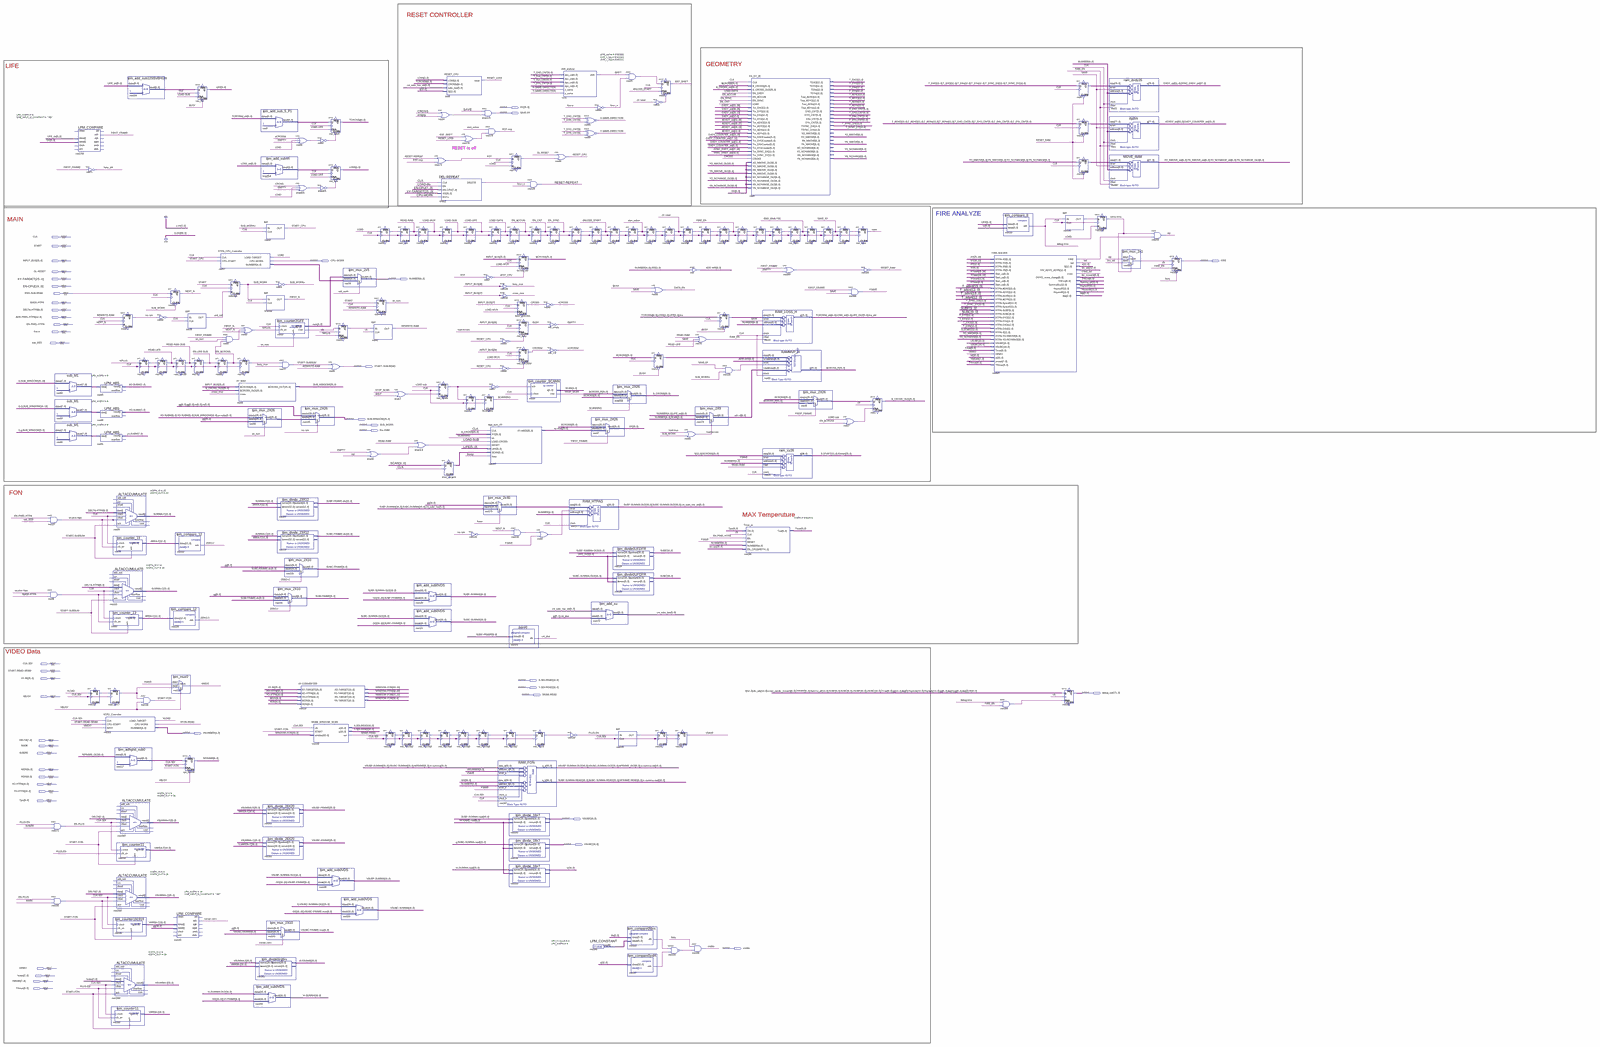
[diagram p0: schematic sheet, whole]
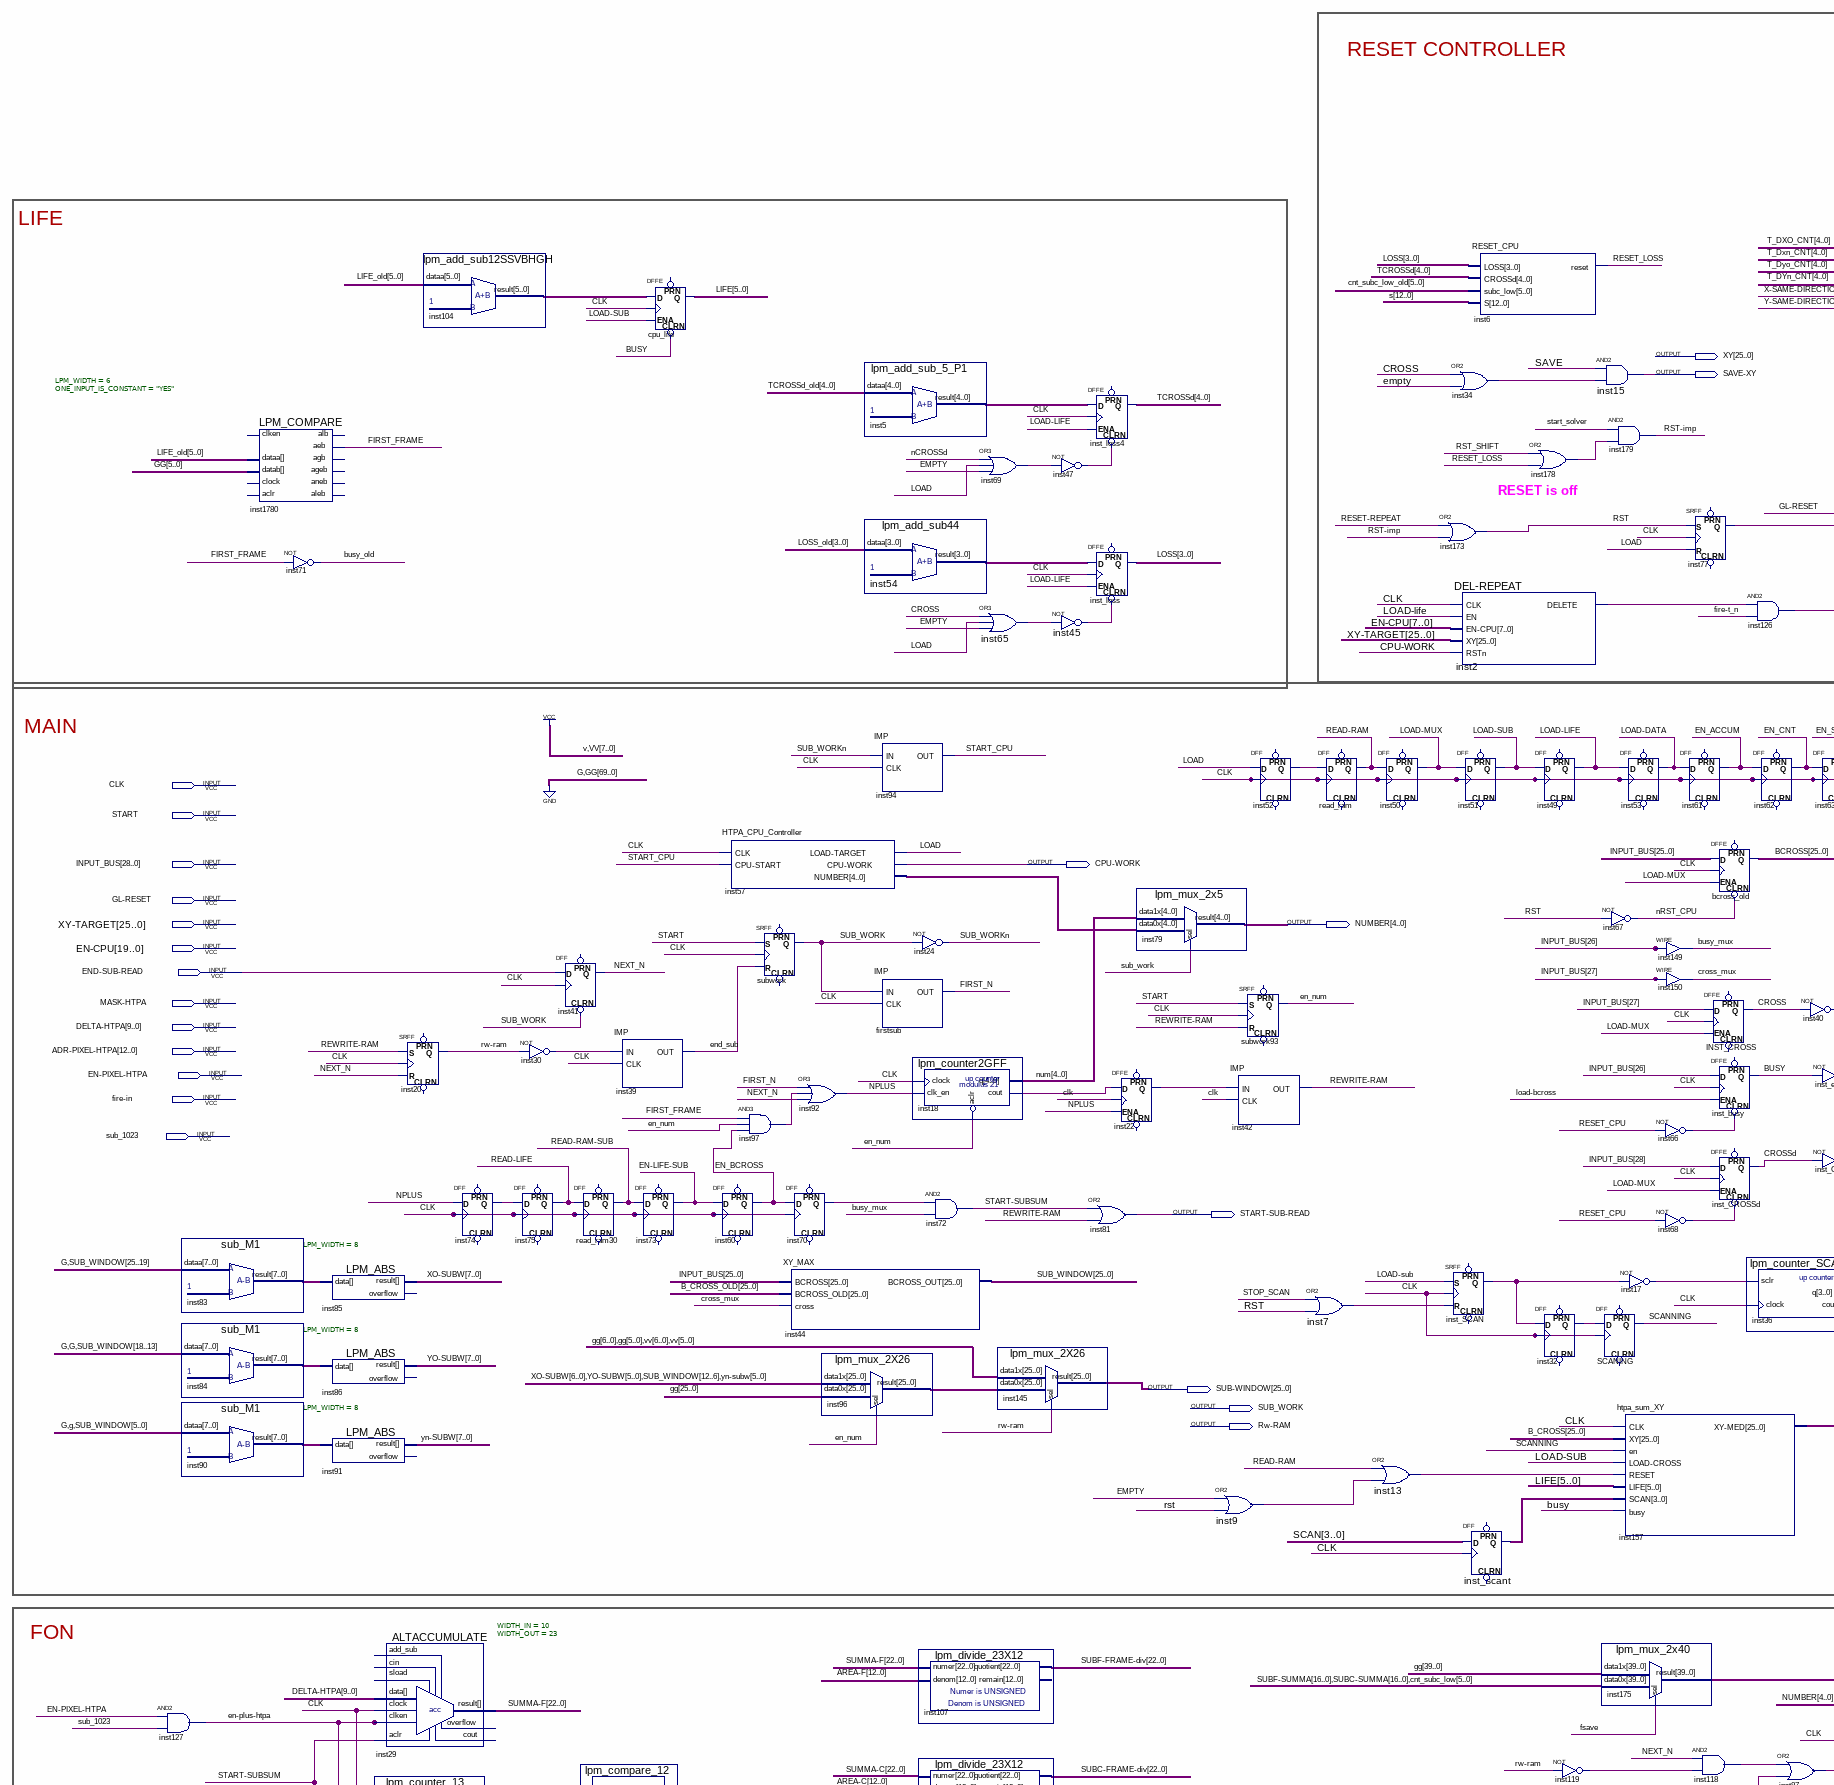
[diagram p1: schematic sheet, upper left part]
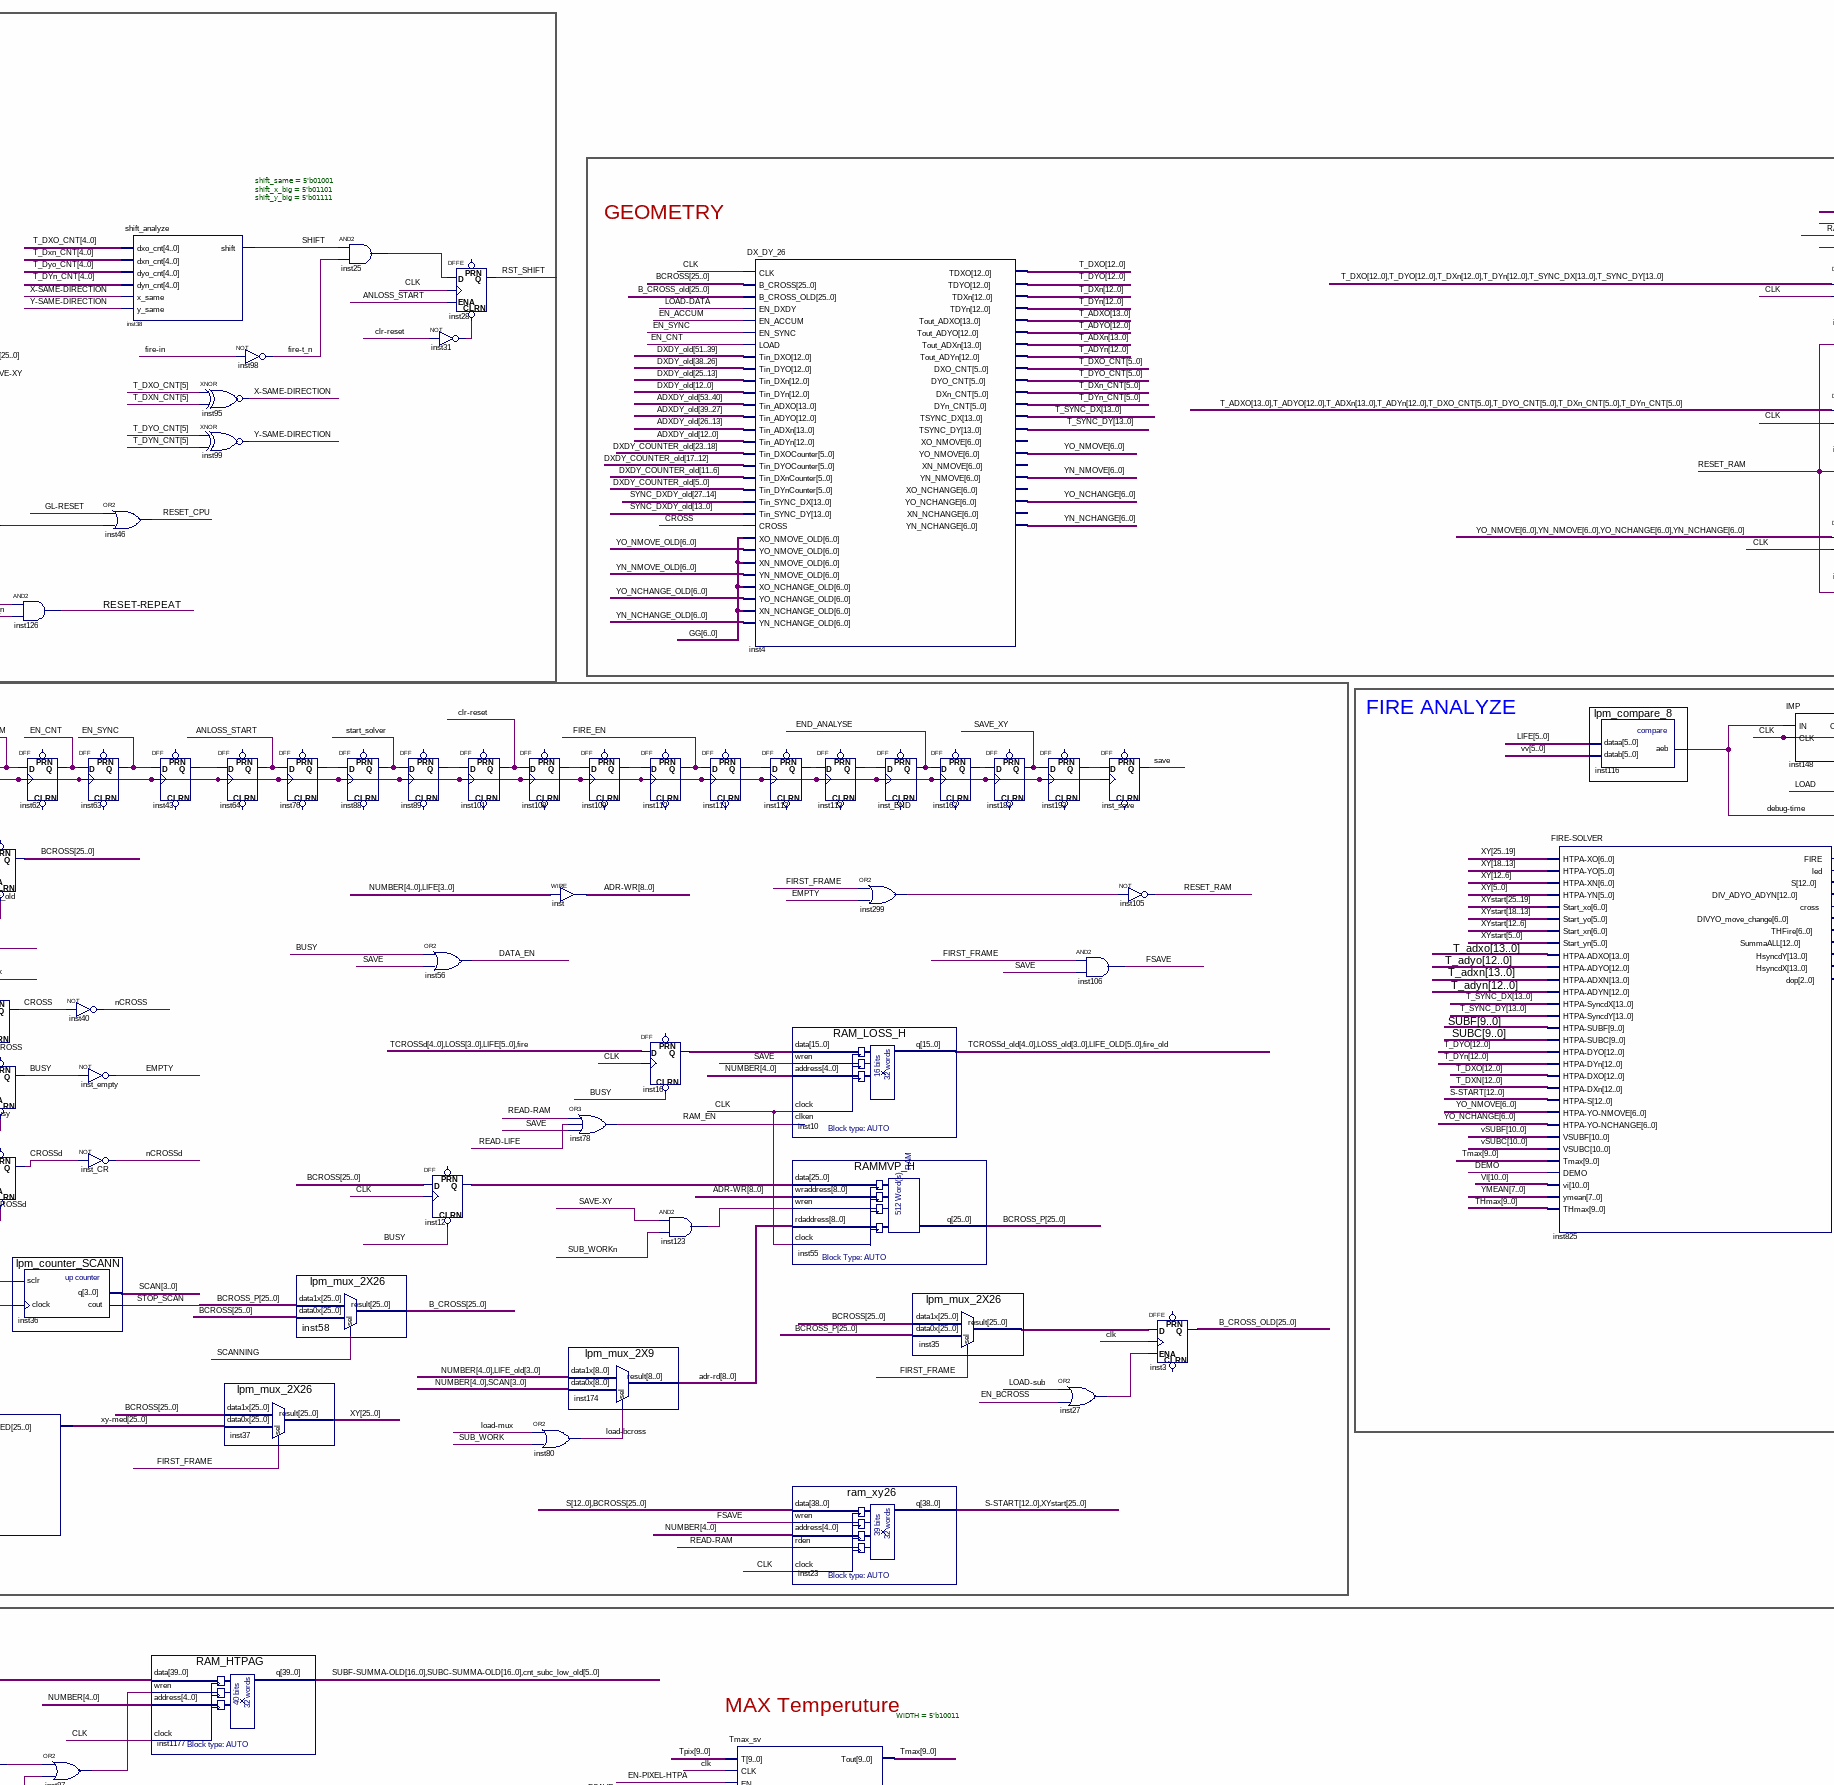
[diagram p2: schematic sheet, upper centre part]
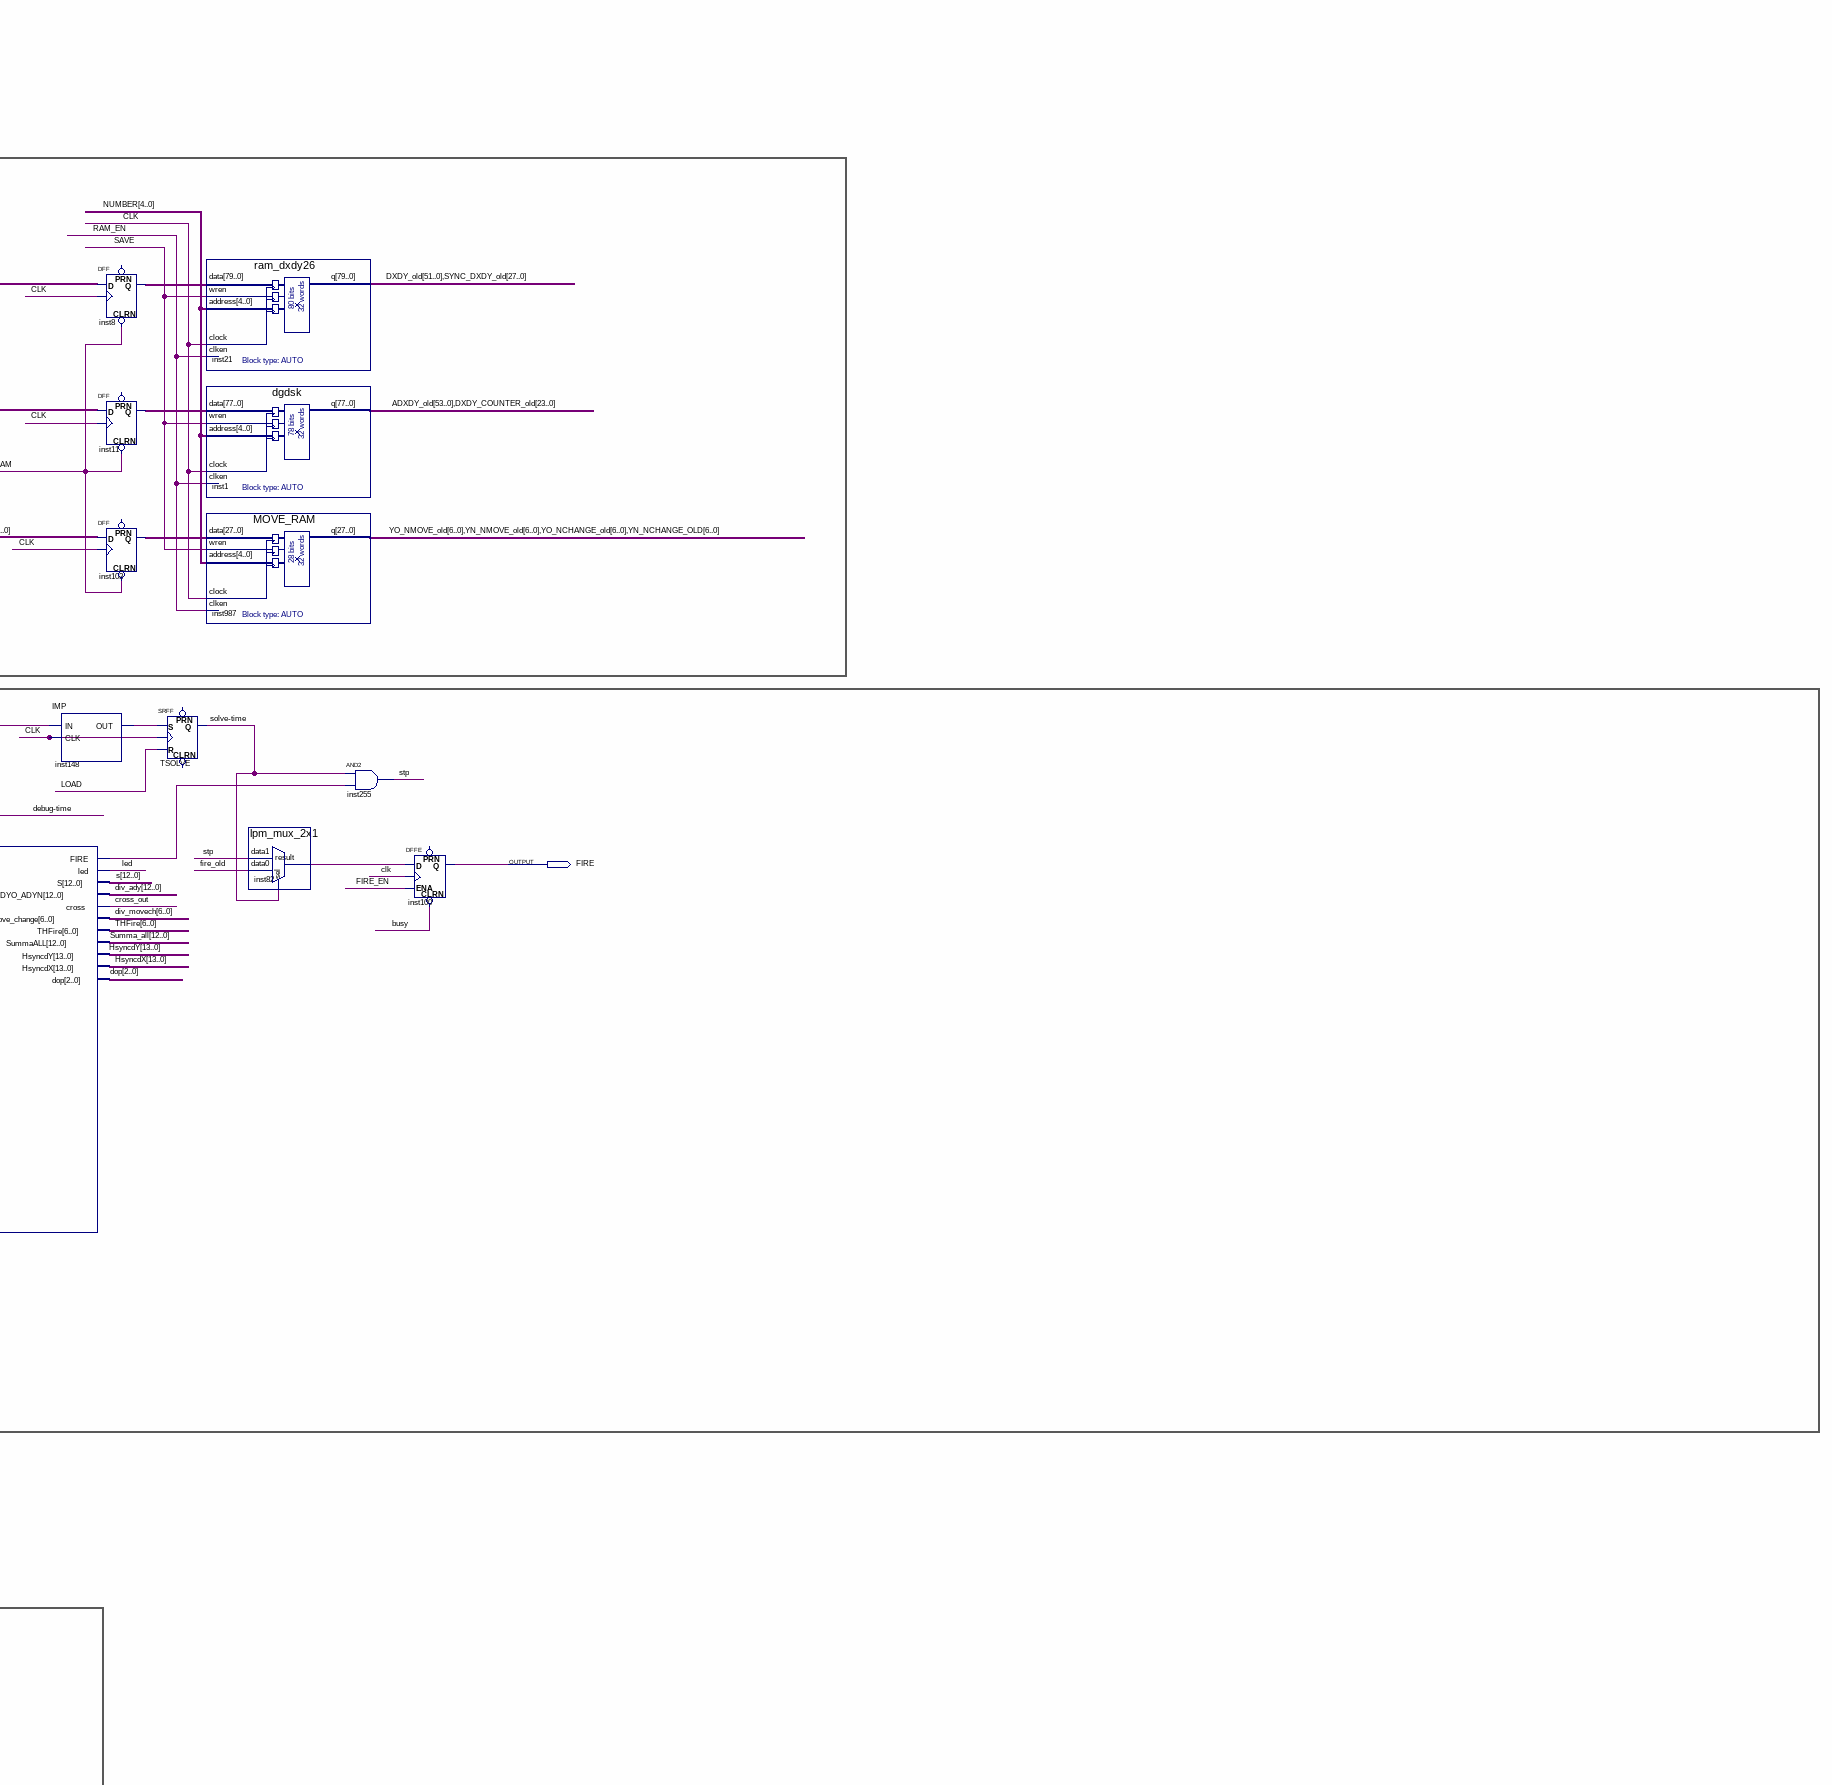
[diagram p3: schematic sheet, upper right part]
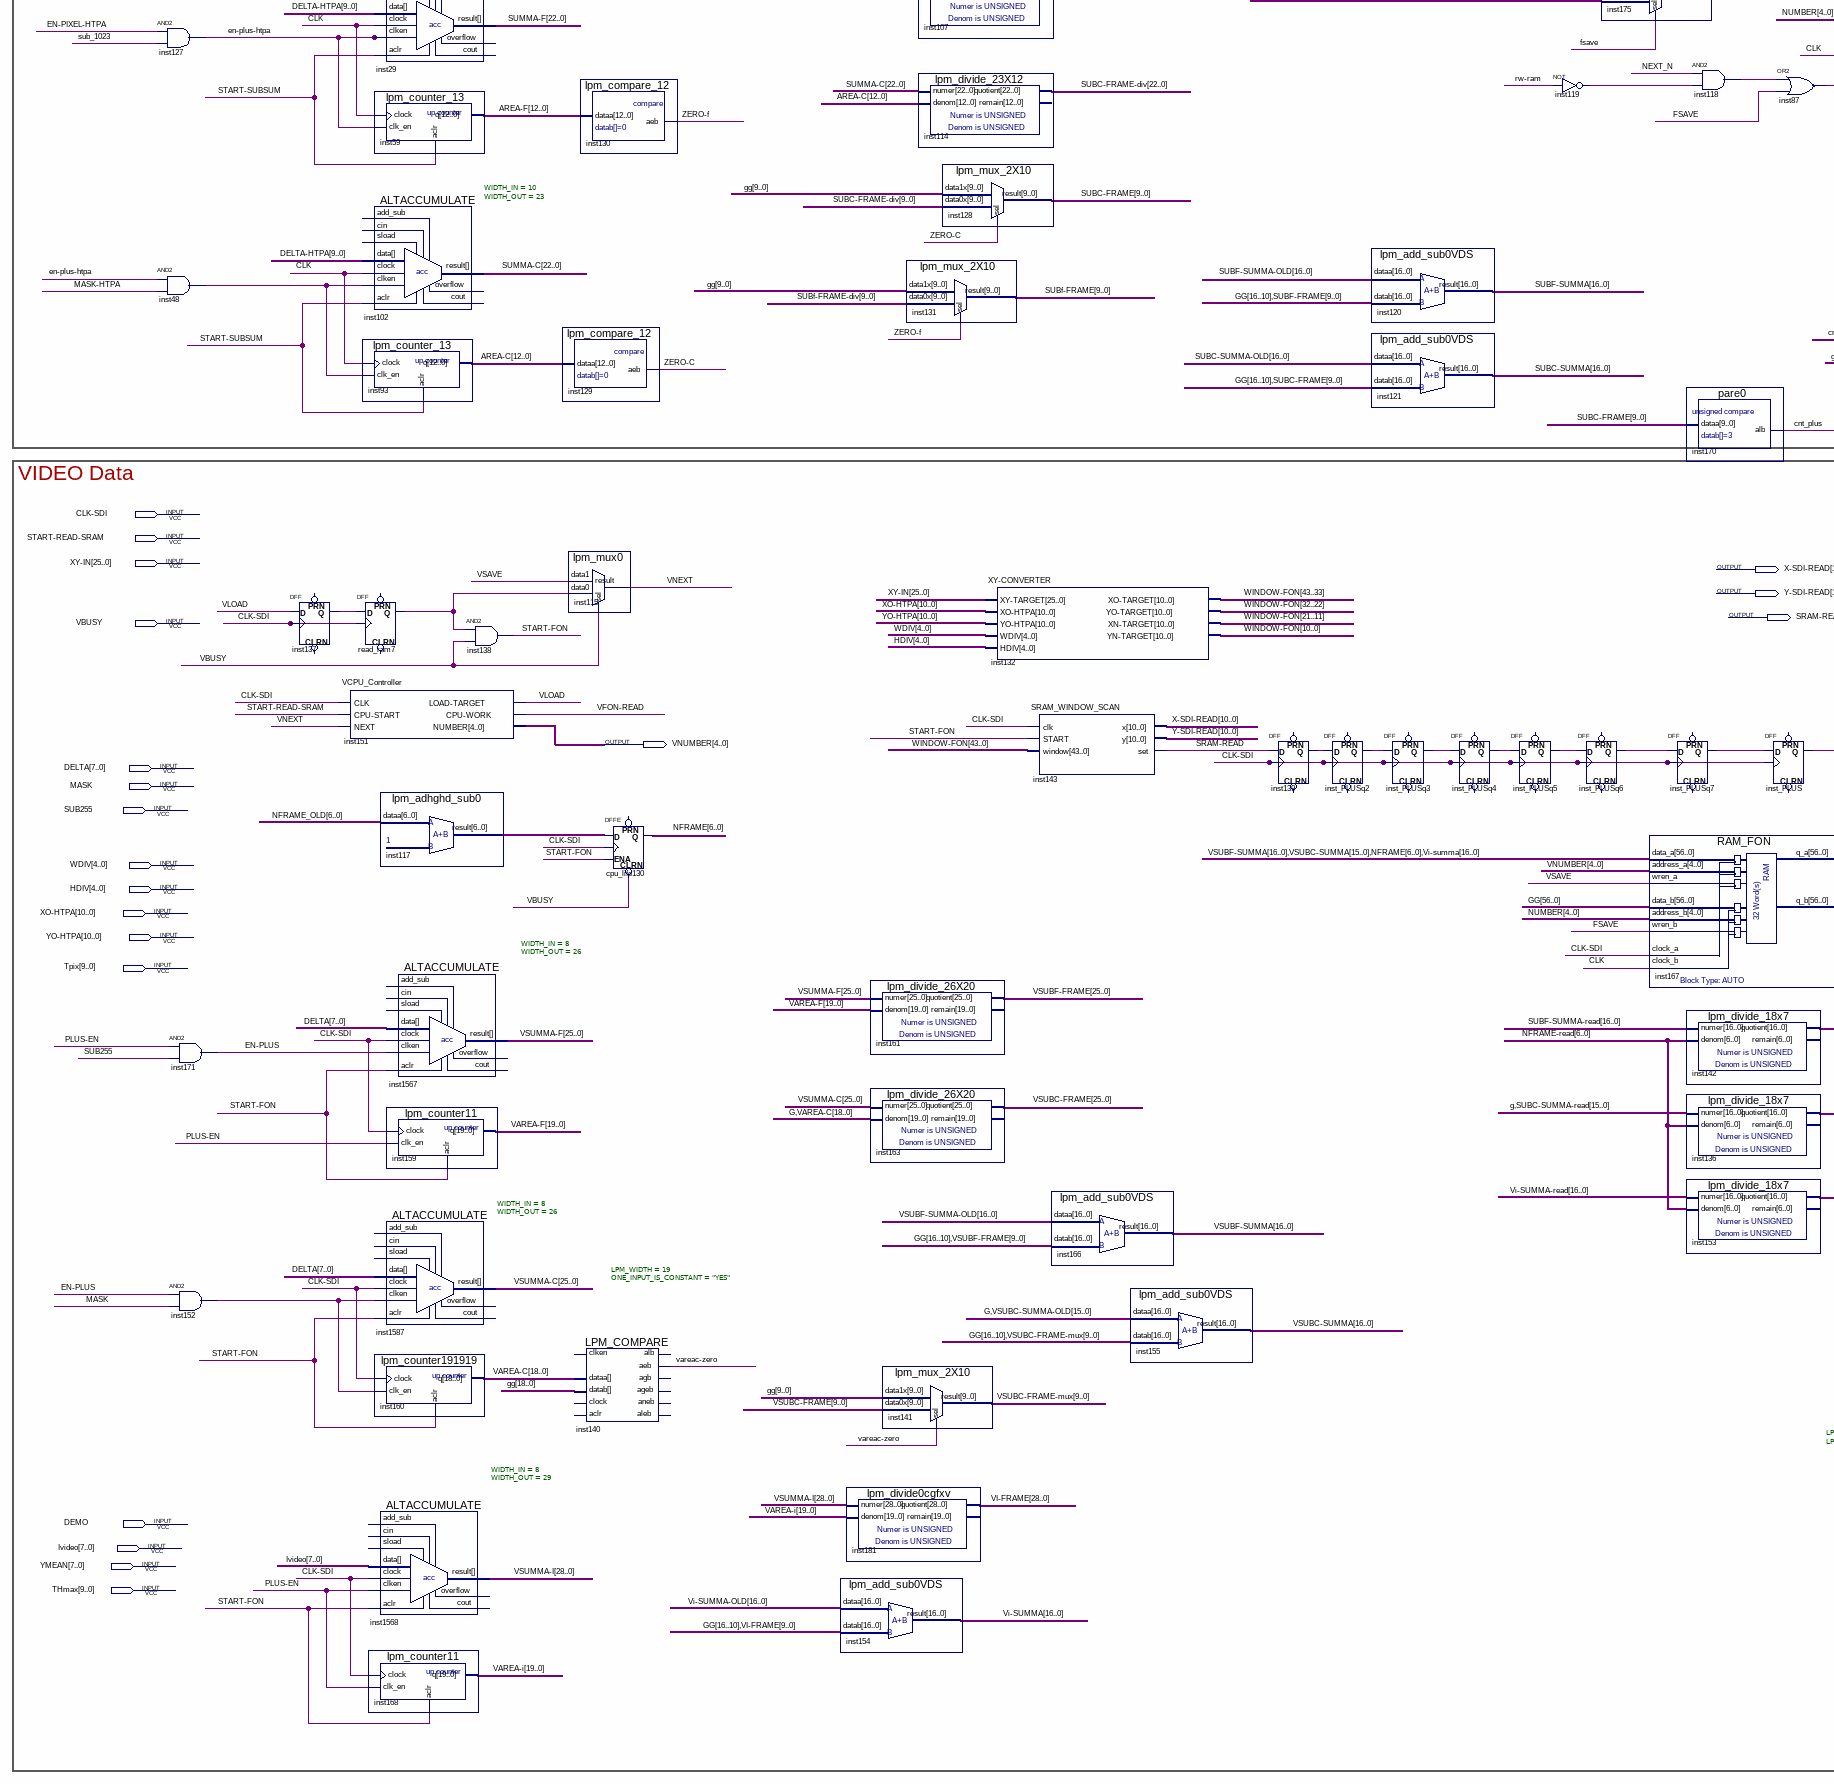
[diagram p4: schematic sheet, lower left part]
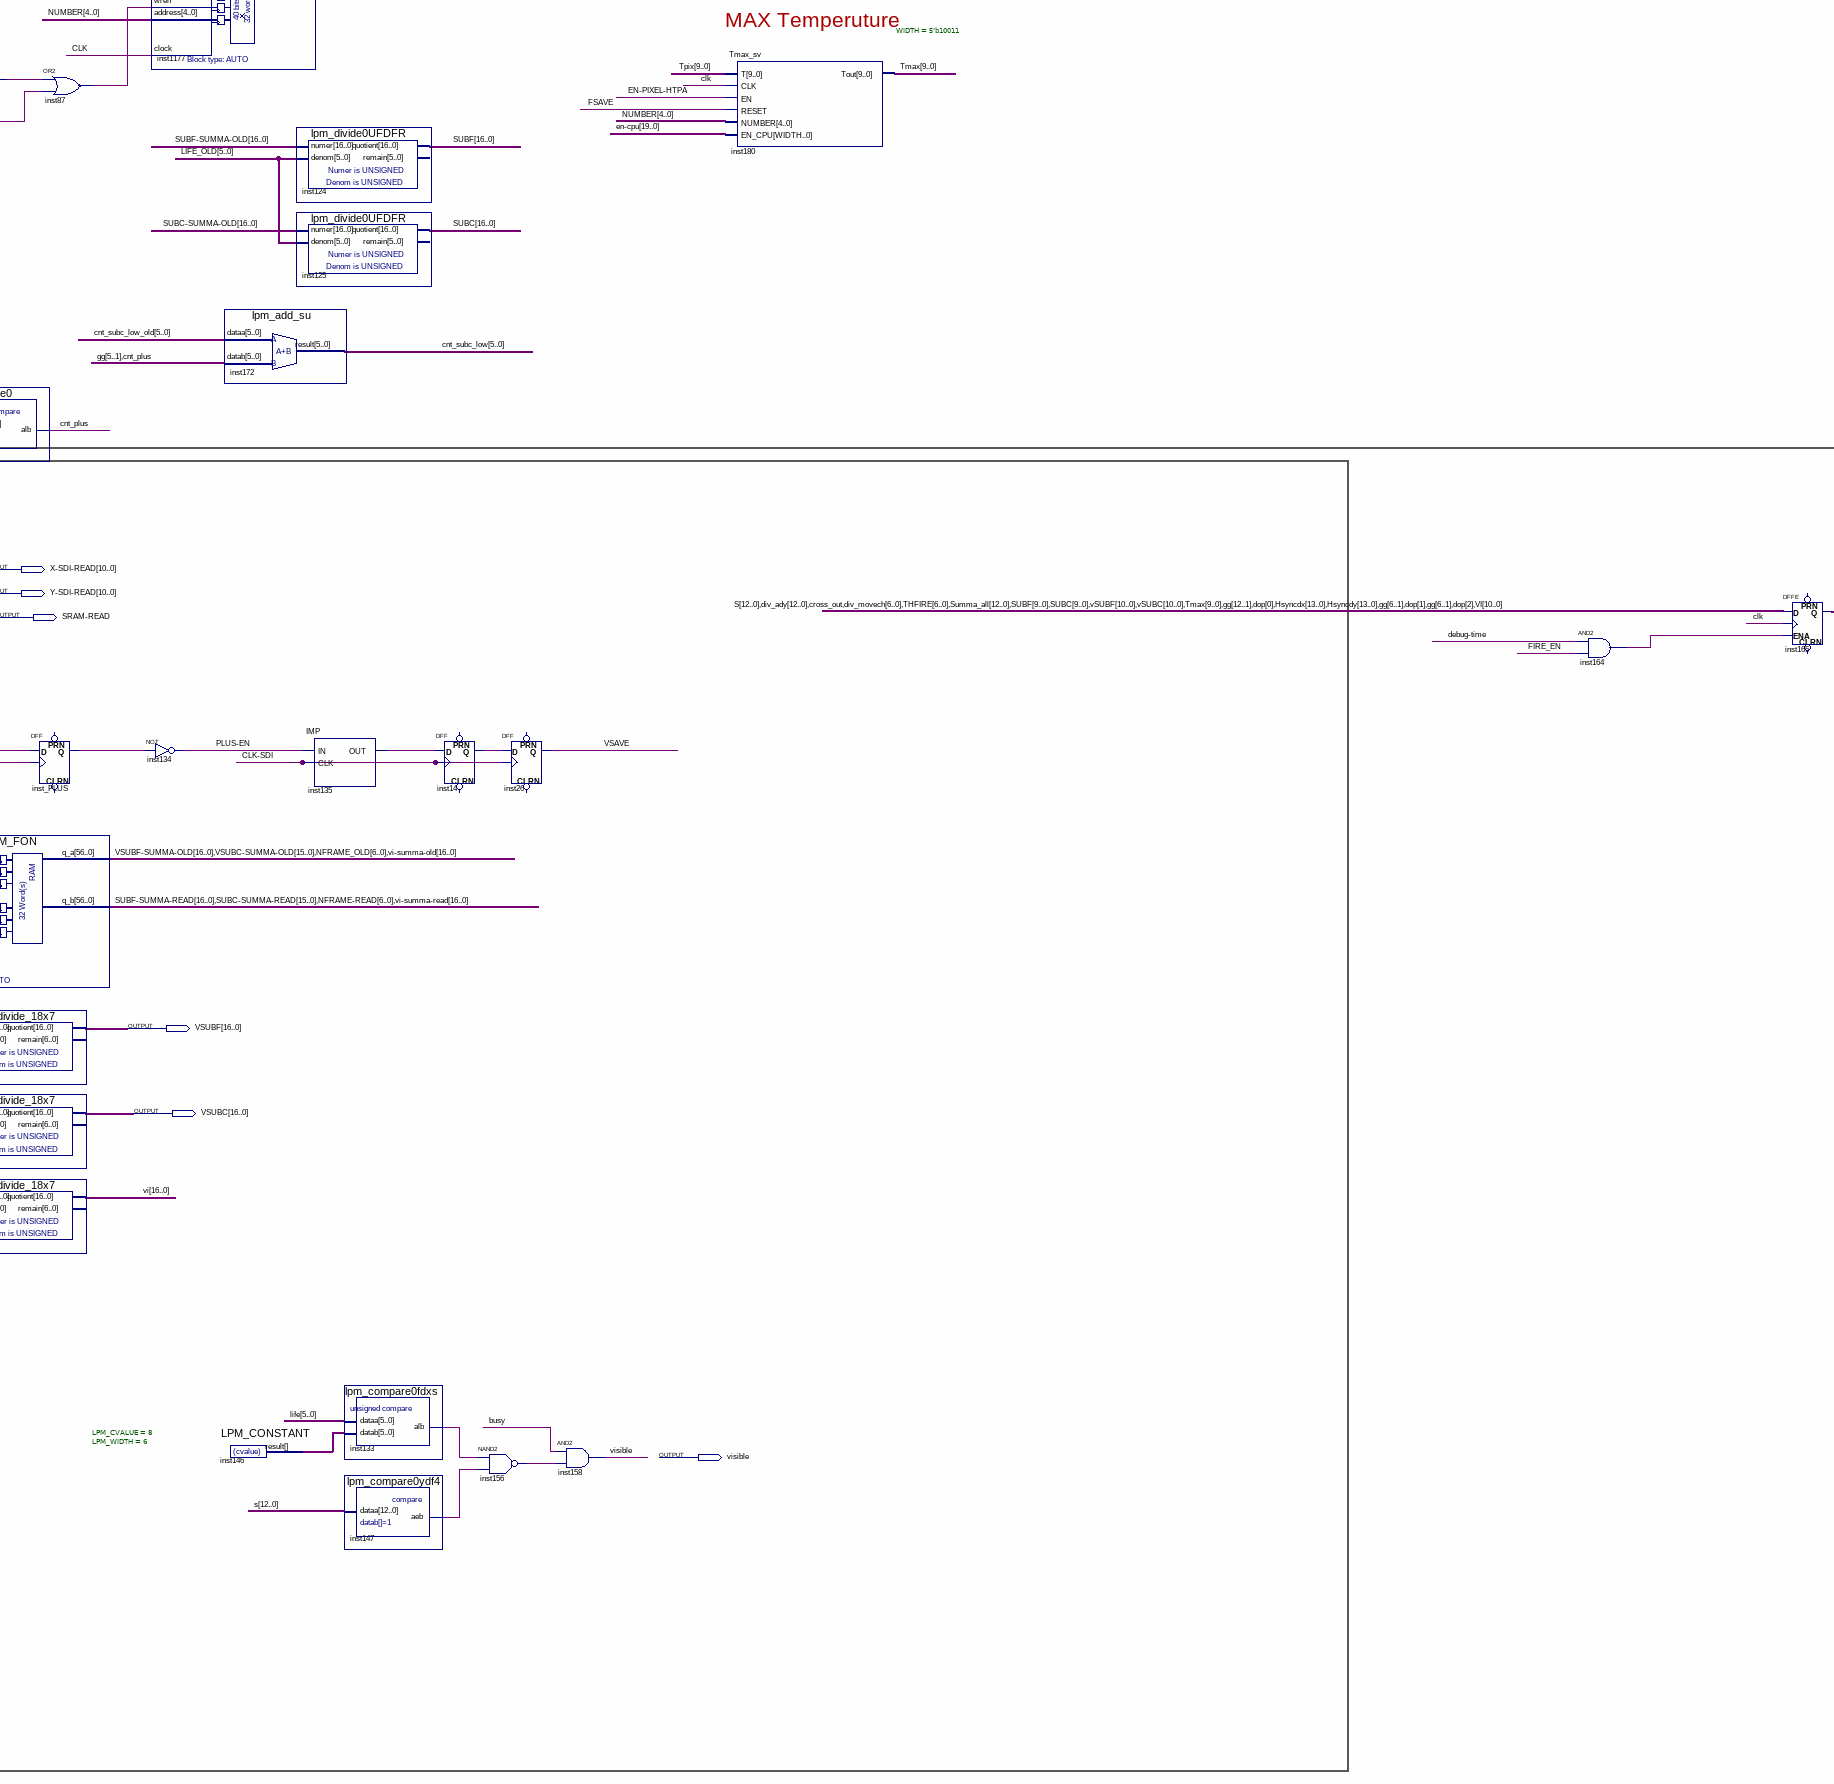
[diagram p5: schematic sheet, lower centre part]
// Quartus schematic HTPA_CPU_new.bdf as structural Verilog: 215 symbols, 46 pins
module HTPA_CPU_new (
  input  CLK,
  input  START,
  input  [28:0] INPUT_BUS,
  input  \GL-RESET ,
  input  [25:0] \XY-TARGET ,
  input  [19:0] \EN-CPU ,
  input  \END-SUB-READ ,
  input  \MASK-HTPA ,
  input  [9:0] \DELTA-HTPA ,
  input  [12:0] \ADR-PIXEL-HTPA ,
  input  \EN-PIXEL-HTPA ,
  input  \fire-in ,
  input  sub_1023,
  input  \CLK-SDI ,
  input  \START-READ-SRAM ,
  input  [25:0] \XY-IN ,
  input  VBUSY,
  input  [7:0] DELTA,
  input  MASK,
  input  SUB255,
  input  [4:0] WDIV,
  input  [4:0] HDIV,
  input  [10:0] \XO-HTPA ,
  input  [10:0] \YO-HTPA ,
  input  [9:0] Tpix,
  input  DEMO,
  input  [7:0] Ivideo,
  input  [7:0] YMEAN,
  input  [9:0] THmax,
  output [25:0] XY,
  output \SAVE-XY ,
  output \CPU-WORK ,
  output FIRE,
  output [4:0] NUMBER,
  output \START-SUB-READ ,
  output [25:0] \SUB-WINDOW ,
  output SUB_WORK,
  output \Rw-RAM ,
  output [10:0] \X-SDI-READ ,
  output [10:0] \Y-SDI-READ ,
  output [171:0] debug_out,
  output \SRAM-READ ,
  output [4:0] VNUMBER,
  output [16:0] VSUBF,
  output [16:0] VSUBC,
  output visible
);

  wire ANLOSS_START, BUSY, busy_mux, busy_old, \clr-reset , cnt_plus, CROSS, cross_mux, cross_out, CROSSd,
       DATA_EN, \debug-time , EMPTY, \EN-LIFE-SUB , \EN-PLUS , \en-plus-htpa , EN_ACCUM, EN_BCROSS, EN_CNT,
       en_num, EN_SYNC, END_ANALYSE, end_sub, \fire-t_n , FIRE_EN, fire_old, FIRST_FRAME, FIRST_N, FSAVE,
       inst2_delete, inst7_out, inst9_out, inst13_out, inst14_q, inst17_out, inst18_cout, inst22_q,
       inst25_out, inst27_out, inst30_out, inst31_out, inst32_q, inst34_out, inst43_q, inst45_out,
       inst47_out, inst48_out, inst52_q, inst65_out, inst66_out, inst68_out, inst69_out, inst70_q, inst74_q,
       inst76_q, inst77_q, inst82_result, inst87_out, inst89_q, inst97_out, inst108_q, inst109_q, inst111_q,
       inst112_q, inst113_q, inst118_out, inst119_out, inst123_out, inst133_alb, inst134_out, inst135_out,
       inst137_q, inst139_q, inst147_aeb, inst148_out, inst152_out, inst156_out, inst162_q, inst164_out,
       inst178_out, inst193_q, inst299_out, inst825_fire, inst_PLUSq2_q, inst_PLUSq3_q, inst_PLUSq4_q,
       inst_PLUSq5_q, inst_PLUSq6_q, inst_PLUSq7_q, inst_SCAN_q, led, LOAD, \load-bcross , \LOAD-DATA ,
       \LOAD-LIFE , \LOAD-MUX , \LOAD-SUB , nCROSS, nCROSSd, NEXT_N, NPLUS, nRST_CPU, \PLUS-EN , RAM_EN,
       \READ-LIFE , \READ-RAM , \READ-RAM-SUB , read_ram7_q, \RESET-REPEAT , RESET_CPU, RESET_LOSS,
       RESET_RAM, \REWRITE-RAM , rst, \RST-imp , RST_SHIFT, SAVE, SAVE_XY, SCANNING, SHIFT, \solve-time ,
       \START-FON , \START-SUBSUM , START_CPU, start_solver, STOP_SCAN, stp, SUB_WORKn, \vareac-zero ,
       \VFON-READ , VLOAD, VNEXT, VSAVE, \X-SAME-DIRECTION , \Y-SAME-DIRECTION , \ZERO-C , \ZERO-f ;
  wire [2:0] dop;
  wire [3:0] inst54_result, inst_scant_q, LOSS, LOSS_old, SCAN;
  wire [4:0] inst5_result, inst57_number, num, TCROSSd, TCROSSd_old;
  wire [5:0] cnt_subc_low, cnt_subc_low_old, inst104_result, inst146_result, LIFE, LIFE_old, T_DXN_CNT,
       T_DXO_CNT, T_DYN_CNT, T_DYO_CNT;
  wire [6:0] div_movech, inst117_result, NFRAME, \NFRAME-read , NFRAME_OLD, THFIRE, YN_NCHANGE,
       YN_NCHANGE_OLD, YN_NMOVE, YN_NMOVE_OLD, YO_NCHANGE, YO_NCHANGE_OLD, YO_NMOVE, YO_NMOVE_OLD;
  wire [7:0] inst83_result, inst84_result, inst90_result, \XO-SUBW , \yn-SUBW , \YO-SUBW ;
  wire [8:0] \adr-rd , \ADR-WR ;
  wire [9:0] \SUBC-FRAME , \SUBF-FRAME , Tmax, \VSUBC-FRAME-mux ;
  wire [12:0] \AREA-C , \AREA-F , div_ady, S, \S-START , Summa_all, T_ADYn, T_ADYO, T_DXn, T_DXO, T_DYn,
       T_DYO;
  wire [13:0] Hsyncdx, Hsyncdy, T_ADXn, T_ADXO, T_SYNC_DX, T_SYNC_DY;
  wire [15:0] inst16_q, \SUBC-SUMMA-read , \VSUBC-SUMMA-OLD ;
  wire [16:0] SUBC, \SUBC-SUMMA , \SUBC-SUMMA-OLD , SUBF, \SUBF-SUMMA , \SUBF-SUMMA-OLD , \SUBF-SUMMA-read ,
       vi, \Vi-SUMMA , \Vi-SUMMA-OLD , \Vi-SUMMA-read , \VSUBC-SUMMA , \VSUBF-SUMMA , \VSUBF-SUMMA-OLD ;
  wire [18:0] \VAREA-C ;
  wire [19:0] \VAREA-F , \VAREA-i ;
  wire [22:0] \SUBC-FRAME-div , \SUBf-FRAME-div , \SUMMA-C , \SUMMA-F ;
  wire [23:0] DXDY_COUNTER_old;
  wire [25:0] B_CROSS, B_CROSS_OLD, BCROSS, BCROSS_P, inst12_q, inst35_result, inst96_result, SUB_WINDOW,
       \VSUBC-FRAME , \VSUBF-FRAME , \VSUMMA-C , \VSUMMA-F , \xy-med , XYstart;
  wire [27:0] inst103_q, SYNC_DXDY_old;
  wire [28:0] \VI-FRAME , \VSUMMA-I ;
  wire [39:0] inst175_result;
  wire [43:0] \WINDOW-FON ;
  wire [51:0] DXDY_old;
  wire [53:0] ADXDY_old;
  wire [77:0] inst11_q;
  wire [79:0] inst8_q;

  sub_M1 inst83 (.dataa({1'b0, SUB_WINDOW[25:19]}), .result(inst83_result));
  sub_M1 inst84 (.dataa({2'b00, SUB_WINDOW[18:13]}), .result(inst84_result));
  sub_M1 inst90 (.dataa({2'b00, SUB_WINDOW[5:0]}), .result(inst90_result));
  and inst127 (\en-plus-htpa , \EN-PIXEL-HTPA , sub_1023);
  and inst48 (inst48_out, \en-plus-htpa , \MASK-HTPA );
  and inst171 (\EN-PLUS , \PLUS-EN , SUB255);
  and inst152 (inst152_out, \EN-PLUS , MASK);
  LPM_COMPARE #(.LPM_WIDTH(6), .ONE_INPUT_IS_CONSTANT("YES")) inst1780 (
    .dataa(LIFE_old), .datab({6{1'b0}}), .aeb(FIRST_FRAME));  // open: clock, aclr, clken, aleb, agb, aneb, ageb, alb
  not inst71 (busy_old, FIRST_FRAME);
  LPM_ABS #(.LPM_WIDTH(8)) inst85 (.data(inst83_result), .result(\XO-SUBW ));  // open: overflow
  LPM_ABS #(.LPM_WIDTH(8)) inst86 (.data(inst84_result), .result(\YO-SUBW ));  // open: overflow
  LPM_ABS #(.LPM_WIDTH(8)) inst91 (.data(inst90_result), .result(\yn-SUBW ));  // open: overflow
  DFF inst137 (.CLK(\CLK-SDI ), .D(VLOAD), .Q(inst137_q));  // open: CLRN, PRN
  ALTACCUMULATE #(.WIDTH_IN(10), .WIDTH_OUT(23)) inst29 (
    .aclr(\START-SUBSUM ), .clock(CLK), .clken(\en-plus-htpa ), .data(\DELTA-HTPA ), .result(\SUMMA-F ));  // open: add_sub, cin, sload, cout, overflow
  lpm_counter_13 inst59 (.clock(CLK), .clk_en(\en-plus-htpa ), .aclr(\START-SUBSUM ), .q(\AREA-F ));
  ALTACCUMULATE #(.WIDTH_IN(10), .WIDTH_OUT(23)) inst102 (
    .aclr(\START-SUBSUM ), .clock(CLK), .clken(inst48_out), .data(\DELTA-HTPA ), .result(\SUMMA-C ));  // open: add_sub, cin, sload, cout, overflow
  lpm_counter_13 inst93 (.clock(CLK), .clk_en(inst48_out), .aclr(\START-SUBSUM ), .q(\AREA-C ));
  DFF read_ram7 (.CLK(\CLK-SDI ), .D(inst137_q), .Q(read_ram7_q));  // open: CLRN, PRN
  VCPU_Controller inst151 (
    .CLK(\CLK-SDI ), .\CPU-START (\START-READ-SRAM ), .NEXT(VNEXT), .\LOAD-TARGET (VLOAD),
    .\CPU-WORK (\VFON-READ ), .NUMBER(VNUMBER));
  lpm_adhghd_sub0 inst117 (.dataa(NFRAME_OLD), .result(inst117_result));
  ALTACCUMULATE #(.WIDTH_IN(8), .WIDTH_OUT(26)) inst1587 (
    .aclr(\START-FON ), .clock(\CLK-SDI ), .clken(inst152_out), .data(DELTA), .result(\VSUMMA-C ));  // open: add_sub, cin, sload, cout, overflow
  lpm_counter191919 inst160 (.clock(\CLK-SDI ), .clk_en(inst152_out), .aclr(\START-FON ), .q(\VAREA-C ));
  ALTACCUMULATE #(.WIDTH_IN(8), .WIDTH_OUT(29)) inst1568 (
    .aclr(\START-FON ), .clock(\CLK-SDI ), .clken(\PLUS-EN ), .data(Ivideo), .result(\VSUMMA-I ));  // open: add_sub, cin, sload, cout, overflow
  lpm_counter11 inst168 (.clock(\CLK-SDI ), .clk_en(\PLUS-EN ), .aclr(\START-FON ), .q(\VAREA-i ));
  lpm_add_sub12SSVBHGH inst104 (.dataa(LIFE_old), .result(inst104_result));
  SRFF inst20 (.S(\REWRITE-RAM ), .R(NEXT_N), .CLK(CLK), .Q(\Rw-RAM ));  // open: PRN, CLRN
  ALTACCUMULATE #(.WIDTH_IN(8), .WIDTH_OUT(26)) inst1567 (
    .aclr(\START-FON ), .clock(\CLK-SDI ), .clken(\EN-PLUS ), .data(DELTA), .result(\VSUMMA-F ));  // open: add_sub, cin, sload, cout, overflow
  lpm_counter11 inst159 (.clock(\CLK-SDI ), .clk_en(\PLUS-EN ), .aclr(\START-FON ), .q(\VAREA-F ));
  DFF inst74 (.CLK(CLK), .D(NPLUS), .Q(inst74_q));  // open: CLRN, PRN
  and inst138 (\START-FON , read_ram7_q, VBUSY);
  not inst30 (inst30_out, \Rw-RAM );
  DFF inst75 (.CLK(CLK), .D(inst74_q), .Q(\READ-LIFE ));  // open: CLRN, PRN
  DFF inst41 (.CLRN(SUB_WORK), .CLK(CLK), .D(\END-SUB-READ ), .Q(NEXT_N));  // open: PRN
  DFF read_ram30 (.CLK(CLK), .D(\READ-LIFE ), .Q(\READ-RAM-SUB ));  // open: CLRN, PRN
  lpm_compare_12 inst129 (.dataa(\AREA-C ), .aeb(\ZERO-C ));
  lpm_mux0 inst115 (.data1(VSAVE), .data0(read_ram7_q), .sel(VBUSY), .result(VNEXT));
  LPM_COMPARE #(.LPM_WIDTH(19), .ONE_INPUT_IS_CONSTANT("YES")) inst140 (
    .dataa(\VAREA-C ), .datab({19{1'b0}}), .aeb(\vareac-zero ));  // open: clock, aclr, clken, aleb, agb, aneb, ageb, alb
  IMP inst39 (.IN(inst30_out), .CLK(CLK), .OUT(end_sub));
  lpm_compare_12 inst130 (.dataa(\AREA-F ), .aeb(\ZERO-f ));
  DFFE cpu_life130[6:0] (
    .CLRN(VBUSY), .D(inst117_result), .CLK(\CLK-SDI ), .ENA(\START-FON ), .Q(NFRAME));  // open: PRN
  DFFE cpu_life[5:0] (.CLRN(BUSY), .D(inst104_result), .CLK(CLK), .ENA(\LOAD-SUB ), .Q(LIFE));  // open: PRN
  DFF inst73 (.CLK(CLK), .D(\READ-RAM-SUB ), .Q(\EN-LIFE-SUB ));  // open: CLRN, PRN
  HTPA_CPU_Controller inst57 (
    .CLK(CLK), .\CPU-START (START_CPU), .\LOAD-TARGET (LOAD), .\CPU-WORK (\CPU-WORK ), .NUMBER(inst57_number));
  DFF inst60 (.CLK(CLK), .D(\EN-LIFE-SUB ), .Q(EN_BCROSS));  // open: CLRN, PRN
  SRFF subwork (.S(START), .R(end_sub), .CLK(CLK), .Q(SUB_WORK));  // open: PRN, CLRN
  and inst97 (inst97_out, FIRST_FRAME, en_num, EN_BCROSS);
  or inst92 (NPLUS, FIRST_N, inst97_out, NEXT_N);
  DFF inst70 (.CLK(CLK), .D(EN_BCROSS), .Q(inst70_q));  // open: CLRN, PRN
  XY_MAX inst44 (.BCROSS(INPUT_BUS[25:0]), .BCROSS_OLD(B_CROSS_OLD), .\cross (cross_mux), .BCROSS_OUT(SUB_WINDOW));
  lpm_add_sub_5_P1 inst5 (.dataa(TCROSSd_old), .result(inst5_result));
  lpm_add_sub44 inst54 (.dataa(LOSS_old), .result(inst54_result));
  lpm_mux_2X26 inst96 (
    .data1x({\XO-SUBW [6:0], \YO-SUBW [5:0], SUB_WINDOW[12:6], \yn-SUBW [5:0]}), .data0x({26{1'b0}}),
    .sel(en_num), .result(inst96_result));
  lpm_divide0cgfxv inst181 (.numer(\VSUMMA-I ), .denom(\VAREA-i ), .quotient(\VI-FRAME ));  // open: remain
  lpm_add_sub0VDS inst154 (.dataa(\Vi-SUMMA-OLD ), .datab({{7{1'b0}}, \VI-FRAME [9:0]}), .result(\Vi-SUMMA ));
  IMP inst94 (.IN(SUB_WORKn), .CLK(CLK), .OUT(START_CPU));
  not inst24 (SUB_WORKn, SUB_WORK);
  IMP firstsub (.IN(SUB_WORK), .CLK(CLK), .OUT(FIRST_N));
  lpm_counter2GFF inst18 (.clock(CLK), .clk_en(NPLUS), .aclr(~en_num), .cout(inst18_cout), .q(num));
  lpm_mux_2X10 inst131 (.data1x({10{1'b0}}), .data0x(\SUBf-FRAME-div [9:0]), .sel(\ZERO-f ), .result(\SUBF-FRAME ));
  lpm_divide_26X20 inst161 (.numer(\VSUMMA-F ), .denom(\VAREA-F ), .quotient(\VSUBF-FRAME ));  // open: remain
  lpm_divide_26X20 inst163 (.numer(\VSUMMA-C ), .denom({1'b0, \VAREA-C }), .quotient(\VSUBC-FRAME ));  // open: remain
  lpm_mux_2X10 inst141 (
    .data1x({10{1'b0}}), .data0x(\VSUBC-FRAME [9:0]), .sel(\vareac-zero ), .result(\VSUBC-FRAME-mux ));
  and inst72 (\START-SUBSUM , inst70_q, busy_mux);
  lpm_divide_23X12 inst107 (.numer(\SUMMA-F ), .denom(\AREA-F ), .quotient(\SUBf-FRAME-div ));  // open: remain
  lpm_divide_23X12 inst114 (.numer(\SUMMA-C ), .denom(\AREA-C ), .quotient(\SUBC-FRAME-div ));  // open: remain
  lpm_mux_2X10 inst128 (.data1x({10{1'b0}}), .data0x(\SUBC-FRAME-div [9:0]), .sel(\ZERO-C ), .result(\SUBC-FRAME ));
  or inst69 (inst69_out, nCROSSd, LOAD, EMPTY);
  or inst65 (inst65_out, CROSS, LOAD, EMPTY);
  lpm_mux_2X26 inst145 (
    .data1x(26'b00000000000001111111111111), .data0x(inst96_result), .sel(\Rw-RAM ), .result(\SUB-WINDOW ));
  \XY-CONVERTER  inst132 (
    .\XY-TARGET (\XY-IN ), .\XO-HTPA (\XO-HTPA ), .\YO-HTPA (\YO-HTPA ), .WDIV(WDIV), .HDIV(HDIV),
    .\XO-TARGET (\WINDOW-FON [43:33]), .\YO-TARGET (\WINDOW-FON [32:22]), .\XN-TARGET (\WINDOW-FON [21:11]),
    .\YN-TARGET (\WINDOW-FON [10:0]));
  not inst47 (inst47_out, inst69_out);
  not inst45 (inst45_out, inst65_out);
  SRAM_WINDOW_SCAN inst143 (
    .clk(\CLK-SDI ), .START(\START-FON ), .window(\WINDOW-FON ), .x(\X-SDI-READ ), .y(\Y-SDI-READ ),
    .set(\SRAM-READ ));
  lpm_add_sub0VDS inst166 (.dataa(\VSUBF-SUMMA-OLD ), .datab({{7{1'b0}}, \VSUBF-FRAME [9:0]}), .result(\VSUBF-SUMMA ));
  DFFE inst_loss4[4:0] (.CLRN(inst47_out), .D(inst5_result), .CLK(CLK), .ENA(\LOAD-LIFE ), .Q(TCROSSd));  // open: PRN
  DFFE inst_loss[3:0] (.CLRN(inst45_out), .D(inst54_result), .CLK(CLK), .ENA(\LOAD-LIFE ), .Q(LOSS));  // open: PRN
  or inst81 (\START-SUB-READ , \START-SUBSUM , \REWRITE-RAM );
  lpm_mux_2x5 inst79 (.data1x(num), .data0x(inst57_number), .sel(SUB_WORK), .result(NUMBER));
  DFFE inst22 (.D(inst18_cout), .CLK(CLK), .ENA(NPLUS), .Q(inst22_q));  // open: PRN, CLRN
  lpm_add_sub0VDS inst155 (
    .dataa({1'b0, \VSUBC-SUMMA-OLD }), .datab({{7{1'b0}}, \VSUBC-FRAME-mux }), .result(\VSUBC-SUMMA ));
  DFF inst52 (.CLK(CLK), .D(LOAD), .Q(inst52_q));  // open: CLRN, PRN
  SRFF subwork93 (.S(START), .R(\REWRITE-RAM ), .CLK(CLK), .Q(en_num));  // open: PRN, CLRN
  IMP inst42 (.IN(inst22_q), .CLK(CLK), .OUT(\REWRITE-RAM ));
  or inst9 (inst9_out, EMPTY, rst);
  DFF inst139 (.CLK(\CLK-SDI ), .D(\SRAM-READ ), .Q(inst139_q));  // open: CLRN, PRN
  DFF read_ram (.CLK(CLK), .D(inst52_q), .Q(\READ-RAM ));  // open: CLRN, PRN
  or inst7 (inst7_out, STOP_SCAN, rst);
  DFF inst_PLUSq2 (.CLK(\CLK-SDI ), .D(inst139_q), .Q(inst_PLUSq2_q));  // open: CLRN, PRN
  DFF inst50 (.CLK(CLK), .D(\READ-RAM ), .Q(\LOAD-MUX ));  // open: CLRN, PRN
  or inst13 (inst13_out, \READ-RAM , inst9_out);
  lpm_add_sub0VDS inst120 (.dataa(\SUBF-SUMMA-OLD ), .datab({{7{1'b0}}, \SUBF-FRAME }), .result(\SUBF-SUMMA ));
  lpm_add_sub0VDS inst121 (.dataa(\SUBC-SUMMA-OLD ), .datab({{7{1'b0}}, \SUBC-FRAME }), .result(\SUBC-SUMMA ));
  DFF inst_PLUSq3 (.CLK(\CLK-SDI ), .D(inst_PLUSq2_q), .Q(inst_PLUSq3_q));  // open: CLRN, PRN
  or inst173 (rst, \RESET-REPEAT , \RST-imp );
  SRFF inst_SCAN (.S(\LOAD-SUB ), .R(inst7_out), .CLK(CLK), .Q(inst_SCAN_q));  // open: PRN, CLRN
  RESET_CPU inst6 (.LOSS(LOSS), .CROSSd(TCROSSd), .subc_low(cnt_subc_low_old), .S(S), .reset(RESET_LOSS));
  or inst34 (inst34_out, CROSS, EMPTY);
  \DEL-REPEAT  inst2 (
    .CLK(CLK), .EN(\LOAD-LIFE ), .\EN-CPU (\EN-CPU [7:0]), .XY(\XY-TARGET ), .RSTn(\CPU-WORK ),
    .DELETE(inst2_delete));
  DFF inst51 (.CLK(CLK), .D(\LOAD-MUX ), .Q(\LOAD-SUB ));  // open: CLRN, PRN
  DFF inst_scant[3:0] (.CLK(CLK), .D(SCAN), .Q(inst_scant_q));  // open: CLRN, PRN
  DFF inst_PLUSq4 (.CLK(\CLK-SDI ), .D(inst_PLUSq3_q), .Q(inst_PLUSq4_q));  // open: CLRN, PRN
  or inst178 (inst178_out, RST_SHIFT, RESET_LOSS);
  DFF inst49 (.CLK(CLK), .D(\LOAD-SUB ), .Q(\LOAD-LIFE ));  // open: CLRN, PRN
  DFF inst32 (.CLK(CLK), .D(inst_SCAN_q), .Q(inst32_q));  // open: CLRN, PRN
  DFF inst_PLUSq5 (.CLK(\CLK-SDI ), .D(inst_PLUSq4_q), .Q(inst_PLUSq5_q));  // open: CLRN, PRN
  not inst119 (inst119_out, \Rw-RAM );
  DFF inst_PLUSq6 (.CLK(\CLK-SDI ), .D(inst_PLUSq5_q), .Q(inst_PLUSq6_q));  // open: CLRN, PRN
  and inst15 (\SAVE-XY , SAVE, inst34_out);
  and inst179 (\RST-imp , start_solver, inst178_out);
  DFF inst53 (.CLK(CLK), .D(\LOAD-LIFE ), .Q(\LOAD-DATA ));  // open: CLRN, PRN
  not inst67 (nRST_CPU, rst);
  not inst17 (inst17_out, inst_SCAN_q);
  DFF SCANING (.CLK(CLK), .D(inst32_q), .Q(SCANNING));  // open: CLRN, PRN
  htpa_sum_XY inst157 (
    .CLK(CLK), .XY(B_CROSS), .en(SCANNING), .\LOAD-CROSS (\LOAD-SUB ), .RESET(inst13_out), .LIFE(LIFE),
    .SCAN(inst_scant_q), .busy(BUSY), .\XY-MED (\xy-med ));
  lpm_mux_2x40 inst175 (
    .data1x({40{1'b0}}), .data0x({\SUBF-SUMMA , \SUBC-SUMMA , cnt_subc_low}), .sel(FSAVE),
    .result(inst175_result));
  SRFF inst77 (.S(rst), .R(LOAD), .CLK(CLK), .Q(inst77_q));  // open: PRN, CLRN
  DFF inst61 (.CLK(CLK), .D(\LOAD-DATA ), .Q(EN_ACCUM));  // open: CLRN, PRN
  assign busy_mux = INPUT_BUS[26];  // WIRE inst149
  assign cross_mux = INPUT_BUS[27];  // WIRE inst150
  not inst66 (inst66_out, RESET_CPU);
  not inst68 (inst68_out, RESET_CPU);
  pare0 inst170 (.dataa(\SUBC-FRAME ), .alb(cnt_plus));
  DFF inst_PLUSq7 (.CLK(\CLK-SDI ), .D(inst_PLUSq6_q), .Q(inst_PLUSq7_q));  // open: CLRN, PRN
  RAM_FON inst167 (
    .data_a({\VSUBF-SUMMA , \VSUBC-SUMMA [15:0], NFRAME, \Vi-SUMMA }), .address_a(VNUMBER), .wren_a(VSAVE),
    .data_b({57{1'b0}}), .address_b(NUMBER), .wren_b(FSAVE), .clock_a(\CLK-SDI ), .clock_b(CLK),
    .q_a({\VSUBF-SUMMA-OLD , \VSUBC-SUMMA-OLD , NFRAME_OLD, \Vi-SUMMA-OLD }),
    .q_b({\SUBF-SUMMA-read , \SUBC-SUMMA-read , \NFRAME-read , \Vi-SUMMA-read }));
  lpm_divide_18x7 inst142 (.numer(\SUBF-SUMMA-read ), .denom(\NFRAME-read ), .quotient(VSUBF));  // open: remain
  lpm_divide_18x7 inst136 (.numer({1'b0, \SUBC-SUMMA-read }), .denom(\NFRAME-read ), .quotient(VSUBC));  // open: remain
  lpm_divide_18x7 inst153 (.numer(\Vi-SUMMA-read ), .denom(\NFRAME-read ), .quotient(vi));  // open: remain
  DFFE bcross_old[25:0] (.CLRN(nRST_CPU), .D(INPUT_BUS[25:0]), .CLK(CLK), .ENA(\LOAD-MUX ), .Q(BCROSS));  // open: PRN
  DFFE INST_CROSS (.D(INPUT_BUS[27]), .CLK(CLK), .ENA(\LOAD-MUX ), .Q(CROSS));  // open: PRN, CLRN
  DFFE inst_busy (.CLRN(inst66_out), .D(INPUT_BUS[26]), .CLK(CLK), .ENA(\load-bcross ), .Q(BUSY));  // open: PRN
  DFFE inst_CROSSd (.CLRN(inst68_out), .D(INPUT_BUS[28]), .CLK(CLK), .ENA(\LOAD-MUX ), .Q(CROSSd));  // open: PRN
  and inst118 (inst118_out, NEXT_N, inst119_out);
  and inst126 (\RESET-REPEAT , inst2_delete, \fire-t_n );
  DFF inst62 (.CLK(CLK), .D(EN_ACCUM), .Q(EN_CNT));  // open: CLRN, PRN
  lpm_counter_SCANN inst36 (.sclr(inst17_out), .clock(CLK), .cout(STOP_SCAN), .q(SCAN));
  or inst87 (inst87_out, inst118_out, FSAVE);
  DFF inst_PLUS (.CLK(\CLK-SDI ), .D(inst_PLUSq7_q), .Q(\PLUS-EN ));  // open: CLRN, PRN
  DFF inst63 (.CLK(CLK), .D(EN_CNT), .Q(EN_SYNC));  // open: CLRN, PRN
  not inst40 (nCROSS, CROSS);
  not inst_empty (EMPTY, BUSY);
  not inst_CR (nCROSSd, CROSSd);
  shift_analyze #(.shift_same(5'b01001), .shift_x_big(5'b01101), .shift_y_big(5'b01111)) inst38 (
    .dxo_cnt(T_DXO_CNT[4:0]), .dxn_cnt(T_DXN_CNT[4:0]), .dyo_cnt(T_DYO_CNT[4:0]), .dyn_cnt(T_DYN_CNT[4:0]),
    .x_same(\X-SAME-DIRECTION ), .y_same(\Y-SAME-DIRECTION ), .shift(SHIFT));
  or inst46 (RESET_CPU, \GL-RESET , inst77_q);
  not inst134 (inst134_out, \PLUS-EN );
  DFF inst43 (.CLK(CLK), .D(EN_SYNC), .Q(inst43_q));  // open: CLRN, PRN
  RAM_HTPAG inst1177 (
    .data(inst175_result), .wren(inst87_out), .address(NUMBER), .clock(CLK),
    .q({\SUBF-SUMMA-OLD , \SUBC-SUMMA-OLD , cnt_subc_low_old}));
  not inst98 (\fire-t_n , \fire-in );
  xnor inst95 (\X-SAME-DIRECTION , T_DXO_CNT[5], T_DXN_CNT[5]);
  xnor inst99 (\Y-SAME-DIRECTION , T_DYO_CNT[5], T_DYN_CNT[5]);
  DFF inst64 (.CLK(CLK), .D(inst43_q), .Q(ANLOSS_START));  // open: CLRN, PRN
  lpm_mux_2X26 inst37 (.data1x(BCROSS), .data0x(\xy-med ), .sel(FIRST_FRAME), .result(XY));
  lpm_add_su inst172 (.dataa(cnt_subc_low_old), .datab({{5{1'b0}}, cnt_plus}), .result(cnt_subc_low));
  LPM_CONSTANT #(.LPM_CVALUE(8), .LPM_WIDTH(6)) inst146 (.result(inst146_result));
  DFF inst76 (.CLK(CLK), .D(ANLOSS_START), .Q(inst76_q));  // open: CLRN, PRN
  and inst25 (inst25_out, SHIFT, \fire-t_n );
  DFF inst88 (.CLK(CLK), .D(inst76_q), .Q(start_solver));  // open: CLRN, PRN
  lpm_mux_2X26 inst58 (.data1x(BCROSS_P), .data0x(BCROSS), .sel(SCANNING), .result(B_CROSS));
  lpm_divide0UFDFR inst124 (.numer(\SUBF-SUMMA-OLD ), .denom(LIFE_old), .quotient(SUBF));  // open: remain
  lpm_divide0UFDFR inst125 (.numer(\SUBC-SUMMA-OLD ), .denom(LIFE_old), .quotient(SUBC));  // open: remain
  IMP inst135 (.IN(inst134_out), .CLK(\CLK-SDI ), .OUT(inst135_out));
  lpm_compare0fdxs inst133 (.dataa(LIFE), .datab(inst146_result), .alb(inst133_alb));
  lpm_compare0ydf4 inst147 (.dataa(S), .aeb(inst147_aeb));
  not inst31 (inst31_out, \clr-reset );
  DFF inst89 (.CLK(CLK), .D(start_solver), .Q(inst89_q));  // open: CLRN, PRN
  or inst56 (DATA_EN, BUSY, SAVE);
  DFF inst12[25:0] (.CLRN(BUSY), .CLK(CLK), .D(BCROSS), .Q(inst12_q));  // open: PRN
  DFF inst14 (.CLK(\CLK-SDI ), .D(inst135_out), .Q(inst14_q));  // open: CLRN, PRN
  DFFE inst28 (.CLRN(inst31_out), .D(inst25_out), .CLK(CLK), .ENA(ANLOSS_START), .Q(RST_SHIFT));  // open: PRN
  DFF inst101 (.CLK(CLK), .D(inst89_q), .Q(\clr-reset ));  // open: CLRN, PRN
  nand inst156 (inst156_out, inst133_alb, inst147_aeb);
  DFF inst108 (.CLK(CLK), .D(\clr-reset ), .Q(inst108_q));  // open: CLRN, PRN
  or inst80 (\load-bcross , \LOAD-MUX , SUB_WORK);
  DFF inst26 (.CLK(\CLK-SDI ), .D(inst14_q), .Q(VSAVE));  // open: CLRN, PRN
  DFF inst109 (.CLK(CLK), .D(inst108_q), .Q(inst109_q));  // open: CLRN, PRN
  assign \ADR-WR  = {NUMBER, LIFE[3:0]};  // WIRE inst
  or inst78 (RAM_EN, \READ-RAM , \READ-LIFE , SAVE);
  lpm_mux_2X9 inst174 (
    .data1x({NUMBER, LIFE_old[3:0]}), .data0x({NUMBER, SCAN}), .sel(\load-bcross ), .result(\adr-rd ));
  and inst158 (visible, BUSY, inst156_out);
  DFF inst110 (.CLK(CLK), .D(inst109_q), .Q(FIRE_EN));  // open: CLRN, PRN
  DFF inst16[15:0] (.CLRN(BUSY), .CLK(CLK), .D({TCROSSd, LOSS, LIFE, FIRE}), .Q(inst16_q));  // open: PRN
  and inst123 (inst123_out, \SAVE-XY , SUB_WORKn);
  DFF inst111 (.CLK(CLK), .D(FIRE_EN), .Q(inst111_q));  // open: CLRN, PRN
  Tmax_sv #(.WIDTH(5'b10011)) inst180 (
    .T(Tpix), .CLK(CLK), .EN(\EN-PIXEL-HTPA ), .RESET(FSAVE), .NUMBER(NUMBER), .EN_CPU(\EN-CPU ), .Tout(Tmax));
  DX_DY_26 inst4 (
    .CLK(CLK), .B_CROSS(BCROSS), .B_CROSS_OLD(B_CROSS_OLD), .EN_DXDY(\LOAD-DATA ), .EN_ACCUM(EN_ACCUM),
    .EN_SYNC(EN_SYNC), .LOAD(EN_CNT), .Tin_DXO(DXDY_old[51:39]), .Tin_DYO(DXDY_old[38:26]),
    .Tin_DXn(DXDY_old[25:13]), .Tin_DYn(DXDY_old[12:0]), .Tin_ADXO(ADXDY_old[53:40]),
    .Tin_ADYO(ADXDY_old[39:27]), .Tin_ADXn(ADXDY_old[26:13]), .Tin_ADYn(ADXDY_old[12:0]),
    .Tin_DXOCounter(DXDY_COUNTER_old[23:18]), .Tin_DYOCounter(DXDY_COUNTER_old[17:12]),
    .Tin_DXnCounter(DXDY_COUNTER_old[11:6]), .Tin_DYnCounter(DXDY_COUNTER_old[5:0]),
    .Tin_SYNC_DX(SYNC_DXDY_old[27:14]), .Tin_SYNC_DY(SYNC_DXDY_old[13:0]), .CROSS(CROSS),
    .XO_NMOVE_OLD({7{1'b0}}), .YO_NMOVE_OLD(YO_NMOVE_OLD), .XN_NMOVE_OLD({7{1'b0}}),
    .YN_NMOVE_OLD(YN_NMOVE_OLD), .XO_NCHANGE_OLD({7{1'b0}}), .YO_NCHANGE_OLD(YO_NCHANGE_OLD),
    .XN_NCHANGE_OLD({7{1'b0}}), .YN_NCHANGE_OLD(YN_NCHANGE_OLD), .TDXO(T_DXO), .TDYO(T_DYO), .TDXn(T_DXn),
    .TDYn(T_DYn), .Tout_ADXO(T_ADXO), .Tout_ADYO(T_ADYO), .Tout_ADXn(T_ADXn), .Tout_ADYn(T_ADYn),
    .DXO_CNT(T_DXO_CNT), .DYO_CNT(T_DYO_CNT), .DXn_CNT(T_DXN_CNT), .DYn_CNT(T_DYN_CNT), .TSYNC_DX(T_SYNC_DX),
    .TSYNC_DY(T_SYNC_DY), .YO_NMOVE(YO_NMOVE), .YN_NMOVE(YN_NMOVE), .YO_NCHANGE(YO_NCHANGE),
    .YN_NCHANGE(YN_NCHANGE));  // open: XO_NMOVE, XN_NMOVE, XO_NCHANGE, XN_NCHANGE
  DFF inst112 (.CLK(CLK), .D(inst111_q), .Q(inst112_q));  // open: CLRN, PRN
  DFF inst113 (.CLK(CLK), .D(inst112_q), .Q(inst113_q));  // open: CLRN, PRN
  RAM_LOSS_H inst10 (
    .data(inst16_q), .wren(SAVE), .address(NUMBER), .clock(CLK), .clken(RAM_EN),
    .q({TCROSSd_old, LOSS_old, LIFE_old, fire_old}));
  RAMMVP_H inst55 (
    .data(inst12_q), .wraddress(\ADR-WR ), .wren(inst123_out), .rdaddress(\adr-rd ), .clock(CLK), .q(BCROSS_P));
  ram_xy26 inst23 (
    .data({S, BCROSS}), .wren(FSAVE), .address(NUMBER), .rden(\READ-RAM ), .clock(CLK),
    .q({\S-START , XYstart}));
  or inst299 (inst299_out, FIRST_FRAME, EMPTY);
  DFF inst_END (.CLK(CLK), .D(inst113_q), .Q(END_ANALYSE));  // open: CLRN, PRN
  lpm_mux_2X26 inst35 (.data1x(BCROSS), .data0x(BCROSS_P), .sel(FIRST_FRAME), .result(inst35_result));
  DFF inst162 (.CLK(CLK), .D(END_ANALYSE), .Q(inst162_q));  // open: CLRN, PRN
  DFF inst183 (.CLK(CLK), .D(inst162_q), .Q(SAVE_XY));  // open: CLRN, PRN
  DFF inst193 (.CLK(CLK), .D(SAVE_XY), .Q(inst193_q));  // open: CLRN, PRN
  or inst27 (inst27_out, \LOAD-SUB , EN_BCROSS);
  DFF inst_save (.CLK(CLK), .D(inst193_q), .Q(SAVE));  // open: CLRN, PRN
  and inst106 (FSAVE, FIRST_FRAME, SAVE);
  not inst105 (RESET_RAM, inst299_out);
  DFFE inst3[25:0] (.D(inst35_result), .CLK(CLK), .ENA(inst27_out), .Q(B_CROSS_OLD));  // open: PRN, CLRN
  \FIRE-SOLVER  inst825 (
    .\HTPA-XO (XY[25:19]), .\HTPA-YO (XY[18:13]), .\HTPA-XN (XY[12:6]), .\HTPA-YN (XY[5:0]),
    .Start_xo(XYstart[25:19]), .Start_yo(XYstart[18:13]), .Start_xn(XYstart[12:6]), .Start_yn(XYstart[5:0]),
    .\HTPA-ADXO (T_ADXO), .\HTPA-ADYO (T_ADYO), .\HTPA-ADXN (T_ADXn), .\HTPA-ADYN (T_ADYn),
    .\HTPA-SyncdX (T_SYNC_DX), .\HTPA-SyncdY (T_SYNC_DY), .\HTPA-SUBF (SUBF[9:0]), .\HTPA-SUBC (SUBC[9:0]),
    .\HTPA-DYO (T_DYO), .\HTPA-DYn (T_DYn), .\HTPA-DXO (T_DXO), .\HTPA-DXn (T_DXn), .\HTPA-S (\S-START ),
    .\HTPA-YO-NMOVE (YO_NMOVE), .\HTPA-YO-NCHANGE (YO_NCHANGE), .VSUBF(VSUBF[10:0]), .VSUBC(VSUBC[10:0]),
    .Tmax(Tmax), .DEMO(DEMO), .vi(vi[10:0]), .ymean(YMEAN), .THmax(THmax), .FIRE(inst825_fire), .led(led),
    .S(S), .DIV_ADYO_ADYN(div_ady), .\cross (cross_out), .DIVYO_move_change(div_movech), .THFire(THFIRE),
    .SummaALL(Summa_all), .HsyncdY(Hsyncdy), .HsyncdX(Hsyncdx), .dop(dop));
  lpm_compare_8 inst116 (.dataa(LIFE), .datab({6{1'b1}}), .aeb(\debug-time ));
  and inst164 (inst164_out, \debug-time , FIRE_EN);
  IMP inst148 (.IN(\debug-time ), .CLK(CLK), .OUT(inst148_out));
  DFFE inst165[171:0] (
    .D({S, div_ady, cross_out, div_movech, THFIRE, Summa_all, SUBF[9:0], SUBC[9:0], VSUBF[10:0], VSUBC[10:0], Tmax, {12{1'b0}}, dop[0], Hsyncdx, Hsyncdy, {6{1'b0}}, dop[1], {6{1'b0}}, dop[2], vi[10:0]}),
    .CLK(CLK), .ENA(inst164_out), .Q(debug_out));  // open: PRN, CLRN
  DFF inst8[79:0] (
    .CLRN(RESET_RAM), .CLK(CLK), .D({T_DXO, T_DYO, T_DXn, T_DYn, T_SYNC_DX, T_SYNC_DY}), .Q(inst8_q));  // open: PRN
  DFF inst11[77:0] (
    .CLRN(RESET_RAM), .CLK(CLK),
    .D({T_ADXO, T_ADYO, T_ADXn, T_ADYn, T_DXO_CNT, T_DYO_CNT, T_DXN_CNT, T_DYN_CNT}), .Q(inst11_q));  // open: PRN
  DFF inst103[27:0] (
    .CLRN(RESET_RAM), .CLK(CLK), .D({YO_NMOVE, YN_NMOVE, YO_NCHANGE, YN_NCHANGE}), .Q(inst103_q));  // open: PRN
  SRFF TSOLVE (.S(inst148_out), .R(LOAD), .CLK(CLK), .Q(\solve-time ));  // open: PRN, CLRN
  ram_dxdy26 inst21 (
    .data(inst8_q), .wren(SAVE), .address(NUMBER), .clock(CLK), .clken(RAM_EN), .q({DXDY_old, SYNC_DXDY_old}));
  dgdsk inst1 (
    .data(inst11_q), .wren(SAVE), .address(NUMBER), .clock(CLK), .clken(RAM_EN),
    .q({ADXDY_old, DXDY_COUNTER_old}));
  MOVE_RAM inst987 (
    .data(inst103_q), .wren(SAVE), .address(NUMBER), .clock(CLK), .clken(RAM_EN),
    .q({YO_NMOVE_OLD, YN_NMOVE_OLD, YO_NCHANGE_OLD, YN_NCHANGE_OLD}));
  lpm_mux_2x1 inst82 (.data1(stp), .data0(fire_old), .sel(\solve-time ), .result(inst82_result));
  and inst255 (stp, \solve-time , inst825_fire);
  DFFE inst100 (.CLRN(BUSY), .D(inst82_result), .CLK(CLK), .ENA(FIRE_EN), .Q(FIRE));  // open: PRN

  // Notes on the sheet:
  //   RESET CONTROLLER
  //   GEOMETRY
  //   LIFE
  //   RESET is off
  //   FIRE ANALYZE
  //   MAIN
  //   FON
  //   MAX Temperuture
  //   VIDEO Data
endmodule
